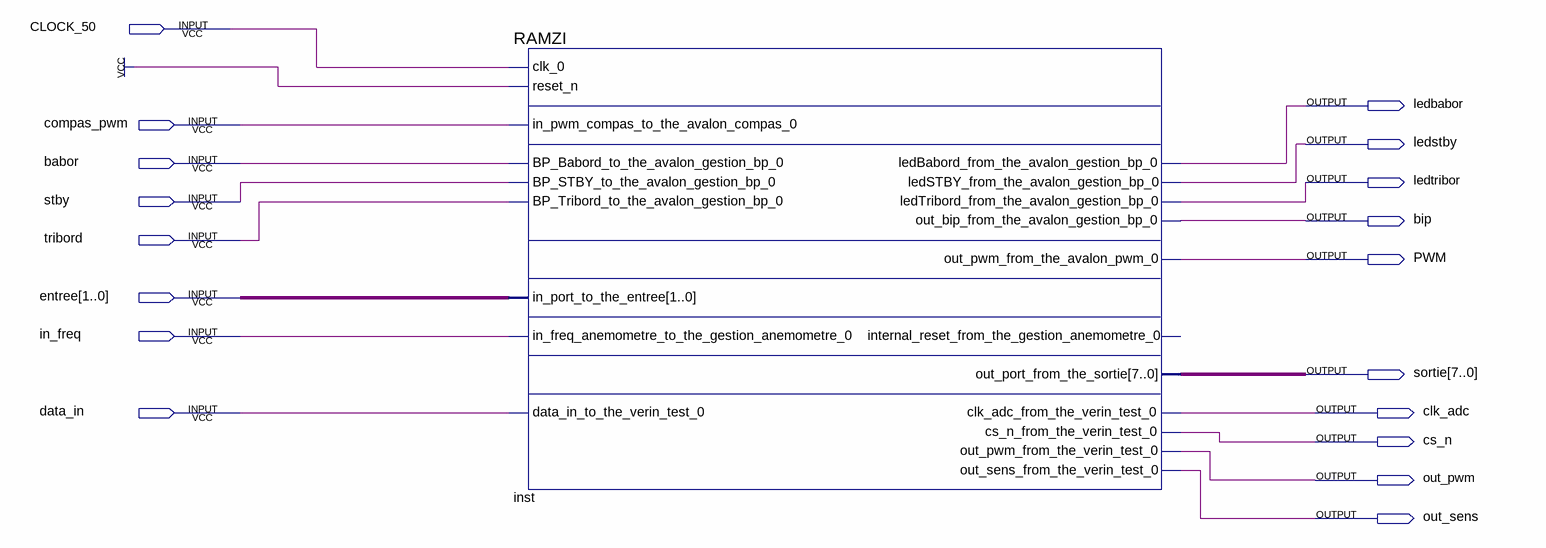
[diagram p0: schematic sheet]
// Quartus schematic BENZ.bdf as structural Verilog: 1 symbols, 18 pins
module BENZ (
  input  CLOCK_50,
  input  compas_pwm,
  input  babor,
  input  stby,
  input  tribord,
  input  [1:0] entree,
  input  in_freq,
  input  data_in,
  output ledbabor,
  output ledstby,
  output ledtribor,
  output bip,
  output PWM,
  output [7:0] sortie,
  output clk_adc,
  output cs_n,
  output out_pwm,
  output out_sens
);

  RAMZI inst (
    .clk_0(CLOCK_50), .reset_n(1'b1), .in_pwm_compas_to_the_avalon_compas_0(compas_pwm),
    .BP_Babord_to_the_avalon_gestion_bp_0(babor), .BP_STBY_to_the_avalon_gestion_bp_0(stby),
    .BP_Tribord_to_the_avalon_gestion_bp_0(tribord), .in_port_to_the_entree(entree),
    .in_freq_anemometre_to_the_gestion_anemometre_0(in_freq), .data_in_to_the_verin_test_0(data_in),
    .ledBabord_from_the_avalon_gestion_bp_0(ledbabor), .ledSTBY_from_the_avalon_gestion_bp_0(ledstby),
    .ledTribord_from_the_avalon_gestion_bp_0(ledtribor), .out_bip_from_the_avalon_gestion_bp_0(bip),
    .out_pwm_from_the_avalon_pwm_0(PWM), .out_port_from_the_sortie(sortie),
    .clk_adc_from_the_verin_test_0(clk_adc), .cs_n_from_the_verin_test_0(cs_n),
    .out_pwm_from_the_verin_test_0(out_pwm), .out_sens_from_the_verin_test_0(out_sens));  // open: internal_reset_from_the_gestion_anemometre_0
endmodule
